# Altium schematic sheet Sheet.SchDoc
size A; DocumentNumber: 1; SheetNumber: 1
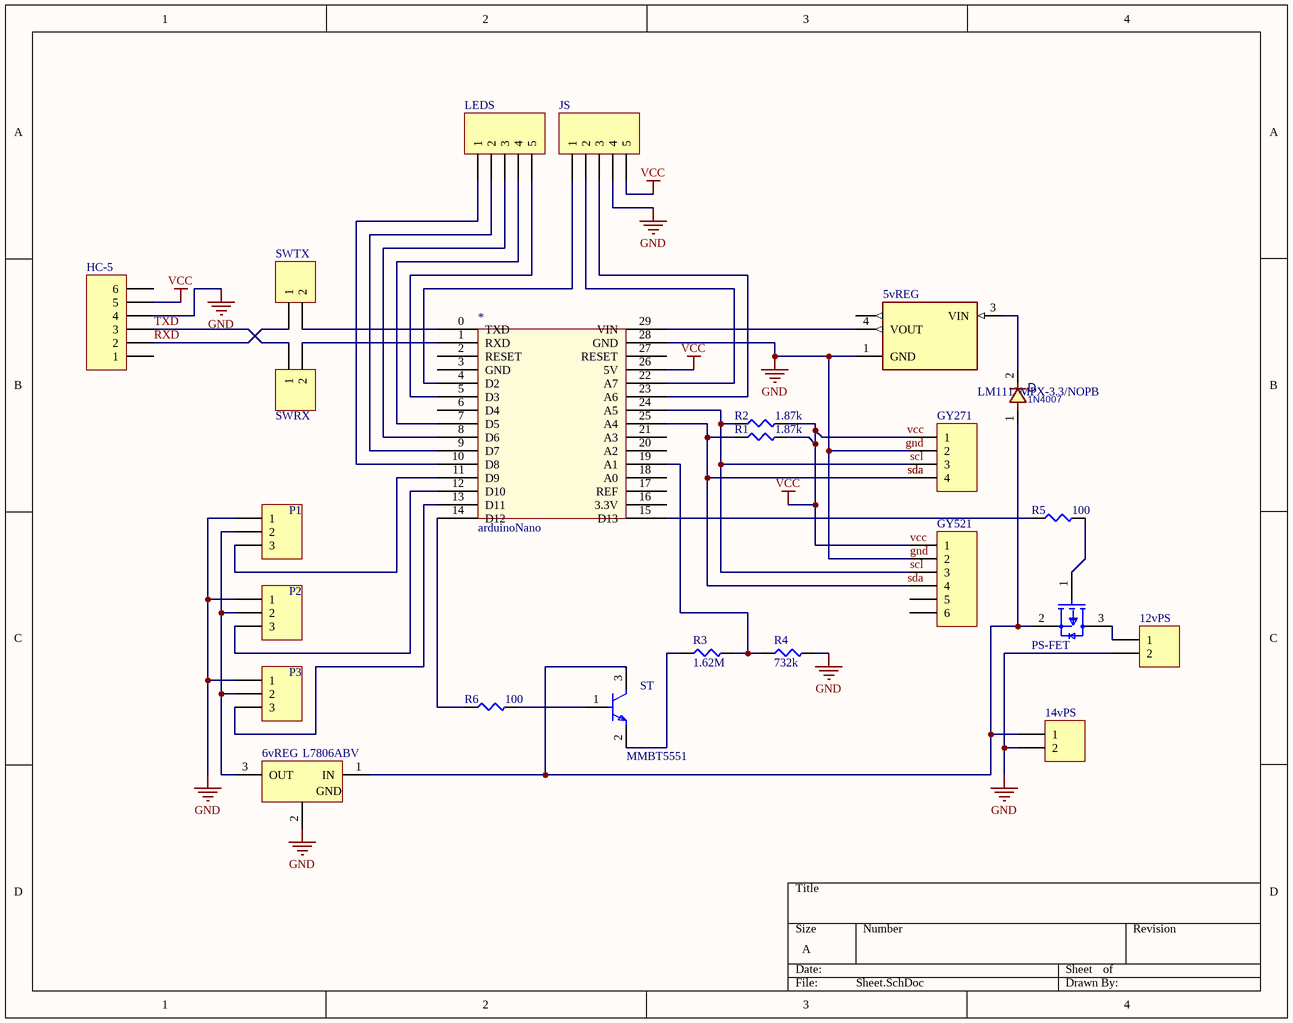
[diagram p0: Sheet.SchDoc]

## Parts
5vREG  LM1117MPX-3.3-NOPB  [Texas_Instruments_LM1117MPX-3.3-NOPB_0]  (value not drawn)
6vREG  L7806ABV  [TO220]
12vPS  Header 2  [HDR1X2]  (value not drawn)
14vPS  Header 2  [HDR1X2]  (value not drawn)
*  arduinoNano  [Arduino nano]
D  1N4007  [D_SMA]
GY271  Header 4  [HDR1X4]  (value not drawn)
GY521  Header 6  [HDR1X6]  (value not drawn)
HC-5  Header 6  [HDR1X6]  (value not drawn)
JS  Header 5  [HDR1X5]  (value not drawn)
LEDS  Header 5  [HDR1X5]  (value not drawn)
P1  Header 3  [HDR1X3]  (value not drawn)
P2  Header 3  [HDR1X3]  (value not drawn)
P3  Header 3  [HDR1X3]  (value not drawn)
PS-FET  SI2301BDS-T1-E3  [Vishay_Siliconix_S-03946_MFG]  (value not drawn)
R1  1.87k  [SMD-1206-RES]
R2  1.87k  [SMD-1206-RES]
R3  1.62M  [SMD-1206-RES]
R4  732k  [SMD-1206-RES]
R5  100  [SMD-1206-RES]
R6  100  [SMD-1206-RES]
ST  MMBT5551  [ON_Semi_318BM_0]  (value not drawn)
SWRX  Header 2  [HDR1X2]  (value not drawn)
SWTX  Header 2  [HDR1X2]  (value not drawn)

## Nets
gnd: 5vREG.1(GND) 6vREG.2(GND) 12vPS.2 14vPS.2 *.28(GND) GY271.2 GY521.2 HC-5.4 JS.4 P1.1 P2.1 P3.1 R4.2
vcc: *.26(5V) GY271.1 GY521.1 HC-5.5 JS.5 R1.2 R2.2
RXD: HC-5.2 SWTX.1
scl: *.24(A5) GY271.3 GY521.3 R2.1
sda: *.25(A4) GY271.4 GY521.4 R1.1
TXD: HC-5.3 SWRX.1
Net5vREG_3: 5vREG.3(VIN) D.2
Net5vREG_4: 5vREG.4(VOUT) *.29(VIN)
Net6vREG_1: 6vREG.1(IN) 14vPS.1 D.1 PS-FET.2(S) ST.3(C)
Net6vREG_3: 6vREG.3(OUT) P1.2 P2.2 P3.2
Net12vPS_1: 12vPS.1 PS-FET.3(D)
Net*_0: *.0(TXD) SWTX.2
Net*_1: *.1(RXD) SWRX.2
Net*_4: *.4(D2) JS.1
Net*_5: *.5(D3) LEDS.5
Net*_7: *.7(D5) LEDS.4
Net*_8: *.8(D6) LEDS.3
Net*_9: *.9(D7) LEDS.2
Net*_10: *.10(D8) LEDS.1
Net*_11: *.11(D9) P1.3
Net*_12: *.12(D10) P2.3
Net*_13: *.13(D11) P3.3
Net*_14: *.14(D12) R6.1
Net*_15: *.15(D13) R5.1
Net*_19: *.19(A1) R3.2 R4.1
Net*_22: *.22(A7) JS.2
Net*_23: *.23(A6) JS.3
NetPS-FET_1: PS-FET.1(G) R5.2
NetR3_1: R3.1 ST.2(E)
NetR6_2: R6.2 ST.1(B)

Not connected (* = marked no-connect by the designer): 5vREG 2(VOUT); * 2(RESET) 3(GND) 6(D4) 16(3.3V) 17(REF) 18(A0) 20(A2) 21(A3) 27(RESET); GY521 5 6; HC-5 1 6

## Library data of the parts
5vREG = LM1117MPX-3.3/NOPB: IC REG LINEAR 3.3V 800MA SOT223; Manufacturer: Texas Instruments; Capacitance: SKIP; Library Path1: parts/IC_Texas_Instruments_LM1117MPX-3.3-NOPB_eec.SchLib; Value: SKIP; Part Number: LM1117MPX-3.3/NOPB; Datasheet Path: datasheets/IC_Texas_Instruments_LM1117MPX-3.3-NOPB_eec.pdf; ComponentLink1Description: Upverter; ComponentLink1URL: https://upverter.com/upn/revision/cd27f63952c6b59d/; ComponentLink2Description: Datasheet; ComponentLink2URL: http://www.ti.com/lit/ds/symlink/lm1117.pdf; Datasheet Path1: datasheets/IC_Texas_Instruments_LM1117MPX-3.3-NOPB_eec.pdf; Digikey Description: IC REG LINEAR 3.3V 800MA SOT223; Digikey Part Number: LM1117MPX-3.3/NOPBCT-ND; Inductance: SKIP; Lead Free: yes; Library Ref1: LM1117MPX-3.3-NOPB; Mouser Part Number: 926-LM1117MPX3.3NOPB; Package: SOT-223; Price: 0.703616332073; Resistance: SKIP; RoHS: TRUE; Supplier 1: Digi-Key; Supplier 2: Mouser; Supplier Part Number 1: LM1117MPX-3.3/NOPBCT-ND; Supplier Part Number 2: 926-LM1117MPX3.3NOPB; Temperature: 0°C to +125°C; Temperature Range High: +125°C; Temperature Range Low: 0°C; Voltage: SKIP; helpURL: https://upverter.com/upn/revision/cd27f63952c6b59d/
6vREG = L7806ABV: Positive Voltage Regulator, 6V, 3-Pin TO-220; ComponentLink1Description: Manufacturer URL; ComponentLink2Description: Datasheet; ComponentLink3Description: Package Specification; ComponentLink3URL: http://www.st.com/internet/com/TECHNICAL_RESOURCES/TECHNICAL_LITERATURE/PACKAGE_INFORMATION/CD00004649.pdf; DatasheetVersion: 16/11/2011; ComponentLink1URL: http://www.st.com; PackageVersion: ver3.0; PackageDescription: TO, Thru-Hole, Vertical, Heatsink Mounted; 3 In-Line Leads; Pitch 2.54 mm; ComponentLink2URL: http://www.st.com/internet/com/TECHNICAL_RESOURCES/TECHNICAL_LITERATURE/DATASHEET/CD00000444.pdf; PackageReference: TO220; PartNumber: L7806ABV
12vPS 14vPS SWRX SWTX = Header 2: Header, 2-Pin; LatestRevisionDate: 17-Jul-2002; LatestRevisionNote: Re-released for DXP Platform.; Publisher: Altium Limited
D = DIODE_SMD_1N4007: DIODE, GENERAL PURPOSE, 1000V/1A; MANF: Kingtronics; DESC: DESCRIPTION; PARAM: 1000V VRRM; PARAM2: 1A; MANF_P#: M7; ASSEMBLY: ASSEMBLY; PRICE: PRICE; VALUE: 1N4007
GY271 = Header 4: Header, 4-Pin; LatestRevisionDate: 17-Jul-2002; LatestRevisionNote: Re-released for DXP Platform.; Publisher: Altium Limited
GY521 HC-5 = Header 6: Header, 6-Pin; LatestRevisionDate: 17-Jul-2002; LatestRevisionNote: Re-released for DXP Platform.; Publisher: Altium Limited
JS LEDS = Header 5: Header, 5-Pin; LatestRevisionDate: 17-Jul-2002; LatestRevisionNote: Re-released for DXP Platform.; Publisher: Altium Limited
P1-P3 = Header 3: Header, 3-Pin; LatestRevisionDate: 17-Jul-2002; LatestRevisionNote: Re-released for DXP Platform.; Publisher: Altium Limited
PS-FET = SI2301BDS-T1-E3: TRANS MOSFET P-CH 20V 2.2A SOT23-3; Manufacturer: Vishay Siliconix; Continuous Drain Current: -2.2A; Depletion Mode: False; Drain To Source Breakdown Voltage: -20V; Drain To Source Resistance: 0.08Ω; Gate Charge At Vgs: 4.5nC @ -4.5V; Gate To Source Voltage: 8V; Input Capacitace At Vds: 375pF @ -6V; Max Forward Diode Voltage: -1.2V; Max Junction Temp: +150°C; Number Of Channels: 1; Power Dissipation: 0.7W; Pulse Drain Current: -10A; Rthja Max: 140°C/W; Standoff Height: 0.01mm; Threshold Vgs Max: -0.95V; Threshold Vgs Min: -0.45V; Transconductance: 6.5S; Turn Off Delay Time: 30ns; Turn On Delay Time: 20ns; Typ Forward Diode Voltage: -0.8V; Verification Version: 0.0.0.3; Datasheet Path: datasheets/Trans_Vishay_Siliconix_SI2301BDS-T1-E3_eec.pdf; Automotive: No; ComponentLink1Description: Upverter; ComponentLink1URL: https://upverter.com/part/id/8ed443e4ece09bfe/; ComponentLink2Description: Datasheet; ComponentLink2URL: http://www.vishay.com/doc?72066; Digikey Description: TRANS MOSFET P-CH 20V 2.2A SOT23-3; Digikey Part Number: SI2301BDS-T1-E3CT-ND; Drain To Source Voltage: -20V; Height: 1.12mm; Ipc Land Pattern Name: SOT95P237X100-3; Lead Free: Yes; Mouser Description: MOSFET 20V 2.0A 0.9W; Mouser Part Number: 781-SI2301BDS-E3; Number Of P Channels: 1; Package: S-03946; Part Number: SI2301BDS-T1-E3; RoHS: TRUE; Supplier 1: Digi-Key; Supplier 2: Mouser; Supplier Part Number 1: SI2301BDS-T1-E3CT-ND; Supplier Part Number 2: 781-SI2301BDS-E3; Temperature: -55°C to +150°C; Temperature Range High: +150°C; Temperature Range Low: -55°C; helpURL: https://upverter.com/part/id/8ed443e4ece09bfe/
R1 R2 = ERJ-8ENF1871V: RES SMD 1.87K OHM 1% 1/4W 1206; Manufacturer: Panasonic Electronic Components; Factory Stock: 0; Unit Price (USD): 0.00933; @ qty: 1500; Minimum Quantity: 1; Power (Watts): 0.25W, 1/4W; Temperature Coefficient: ±100ppm/°C; Part Number: ERJ-8ENF1871V; Datasheets: http://industrial.panasonic.com/www-cgi/jvcr13pz.cgi?E+PZ+3+AOA0002+ERJ8ENF1871V+7+WW; Image: //media.digikey.com/Renders/Panasonic%20Renders/ERJ-1206%20Pkg.jpg; Digi-Key Part Number: P1.87KFCT-ND; Quantity Available: 51643; Packaging: Cut Tape (CT); Series: ERJ; Part Status: Active; Value: 1.87k; Tolerance: ±1%; Composition: Thick Film; Features: Automotive AEC-Q200; Operating Temperature: -55°C ~ 155°C; Package / Case: 1206 (3216 Metric); Supplier Device Package: 1206; Size / Dimension: 0.126" L x 0.063" W (3.20mm x 1.60mm); Height - Seated (Max): 0.028" (0.70mm); Number of Terminations: 2; Failure Rate: -
R3 = ERJ-8ENF1621V: RES SMD 1.62K OHM 1% 1/4W 1206; Manufacturer: Panasonic Electronic Components; Factory Stock: 0; Unit Price (USD): 0.00933; @ qty: 1500; Minimum Quantity: 1; Power (Watts): 0.25W, 1/4W; Temperature Coefficient: ±100ppm/°C; Part Number: ERJ-8ENF1621V; Datasheets: http://industrial.panasonic.com/www-cgi/jvcr13pz.cgi?E+PZ+3+AOA0002+ERJ8ENF1621V+7+WW; Image: //media.digikey.com/Renders/Panasonic%20Renders/ERJ-1206%20Pkg.jpg; Digi-Key Part Number: P1.62KFCT-ND; Quantity Available: 55499; Packaging: Cut Tape (CT); Series: ERJ; Part Status: Active; Value: 1.62k; Tolerance: ±1%; Composition: Thick Film; Features: Automotive AEC-Q200; Operating Temperature: -55°C ~ 155°C; Package / Case: 1206 (3216 Metric); Supplier Device Package: 1206; Size / Dimension: 0.126" L x 0.063" W (3.20mm x 1.60mm); Height - Seated (Max): 0.028" (0.70mm); Number of Terminations: 2; Failure Rate: -
R4 = ERJ-8ENF7323V: RES SMD 732K OHM 1% 1/4W 1206; Manufacturer: Panasonic Electronic Components; Factory Stock: 0; Unit Price (USD): 0.00933; @ qty: 1500; Minimum Quantity: 1; Power (Watts): 0.25W, 1/4W; Temperature Coefficient: ±100ppm/°C; Part Number: ERJ-8ENF7323V; Datasheets: http://industrial.panasonic.com/www-cgi/jvcr13pz.cgi?E+PZ+3+AOA0002+ERJ8ENF7323V+7+WW; Image: //media.digikey.com/Renders/Panasonic%20Renders/ERJ-1206%20Pkg.jpg; Digi-Key Part Number: P732KFCT-ND; Quantity Available: 40849; Packaging: Cut Tape (CT); Series: ERJ; Part Status: Active; Value: 732k; Tolerance: ±1%; Composition: Thick Film; Features: Automotive AEC-Q200; Operating Temperature: -55°C ~ 155°C; Package / Case: 1206 (3216 Metric); Supplier Device Package: 1206; Size / Dimension: 0.126" L x 0.063" W (3.20mm x 1.60mm); Height - Seated (Max): 0.028" (0.70mm); Number of Terminations: 2; Failure Rate: -
R5 R6 = ERJ-8ENF1000V: RES SMD 100 OHM 1% 1/4W 1206; Manufacturer: Panasonic Electronic Components; Factory Stock: 0; Unit Price (USD): 0.00933; @ qty: 1500; Minimum Quantity: 1; Power (Watts): 0.25W, 1/4W; Temperature Coefficient: ±100ppm/°C; Part Number: ERJ-8ENF1000V; Datasheets: http://industrial.panasonic.com/www-cgi/jvcr13pz.cgi?E+PZ+3+AOA0002+ERJ8ENF1000V+7+WW; Image: //media.digikey.com/Renders/Panasonic%20Renders/ERJ-1206%20Pkg.jpg; Digi-Key Part Number: P100FCT-ND; Quantity Available: 384173; Packaging: Cut Tape (CT); Series: ERJ; Part Status: Active; Value: 100; Tolerance: ±1%; Composition: Thick Film; Features: Automotive AEC-Q200; Operating Temperature: -55°C ~ 155°C; Package / Case: 1206 (3216 Metric); Supplier Device Package: 1206; Size / Dimension: 0.126" L x 0.063" W (3.20mm x 1.60mm); Height - Seated (Max): 0.028" (0.70mm); Number of Terminations: 2; Failure Rate: -
ST = MMBT5551: TRANS NPN 160V 0.6A SOT-23; Manufacturer: ON Semi; Capacitance: SKIP; Collector Base Voltage: 180V; Collector Emitter Saturation Voltage: 0.2V; Emitter Base Voltage: 6V; Gain Bandwidth Product: 100MHz; Hfe Min: 80; Library Path1: parts/Trans_ON_Semi_MMBT5551_eec.SchLib; Max Collector Current: 600mA; Max Junction Temp: +150°C; Number Of Elements: 1; Number Of Pnp: 0; Power Dissipation: 350mW; Standoff Height: 0mm; Value: SKIP; Verification Version: 0.0.0.1; Part Number: MMBT5551; Datasheet Path: datasheets/Trans_ON_Semi_MMBT5551_eec.pdf; Collector Emitter Breakdown Voltage: 160V; Collector Emitter Voltage: 160V; ComponentLink1Description: Upverter; ComponentLink1URL: https://upverter.com/upn/revision/1e093772ae9a7220/; ComponentLink2Description: Datasheet; ComponentLink2URL: http://www.onsemi.com/pub/Collateral/2N5551-D.pdf; Datasheet Path1: datasheets/Trans_ON_Semi_MMBT5551_eec.pdf; Digikey Description: TRANS NPN 160V 0.6A SOT-23; Digikey Part Number: MMBT5551FSCT-ND; Footprint Url: http://www.onsemi.com/pub/Collateral/318BM.PDF; Height: 1.2mm; Inductance: SKIP; Lead Free: yes; Library Ref1: MMBT5551; Mouser Part Number: 512-MMBT5551; Number Of Npn: 1; Package: 318BM; Price: SKIP; Resistance: SKIP; RoHS: TRUE; Supplier 1: Digi-Key; Supplier 2: Mouser; Supplier Part Number 1: MMBT5551FSCT-ND; Supplier Part Number 2: 512-MMBT5551; Temperature: to; Voltage: SKIP; helpURL: https://upverter.com/upn/revision/1e093772ae9a7220/